# EAGLE schematic carret (EAGLE 5.11)
A: a
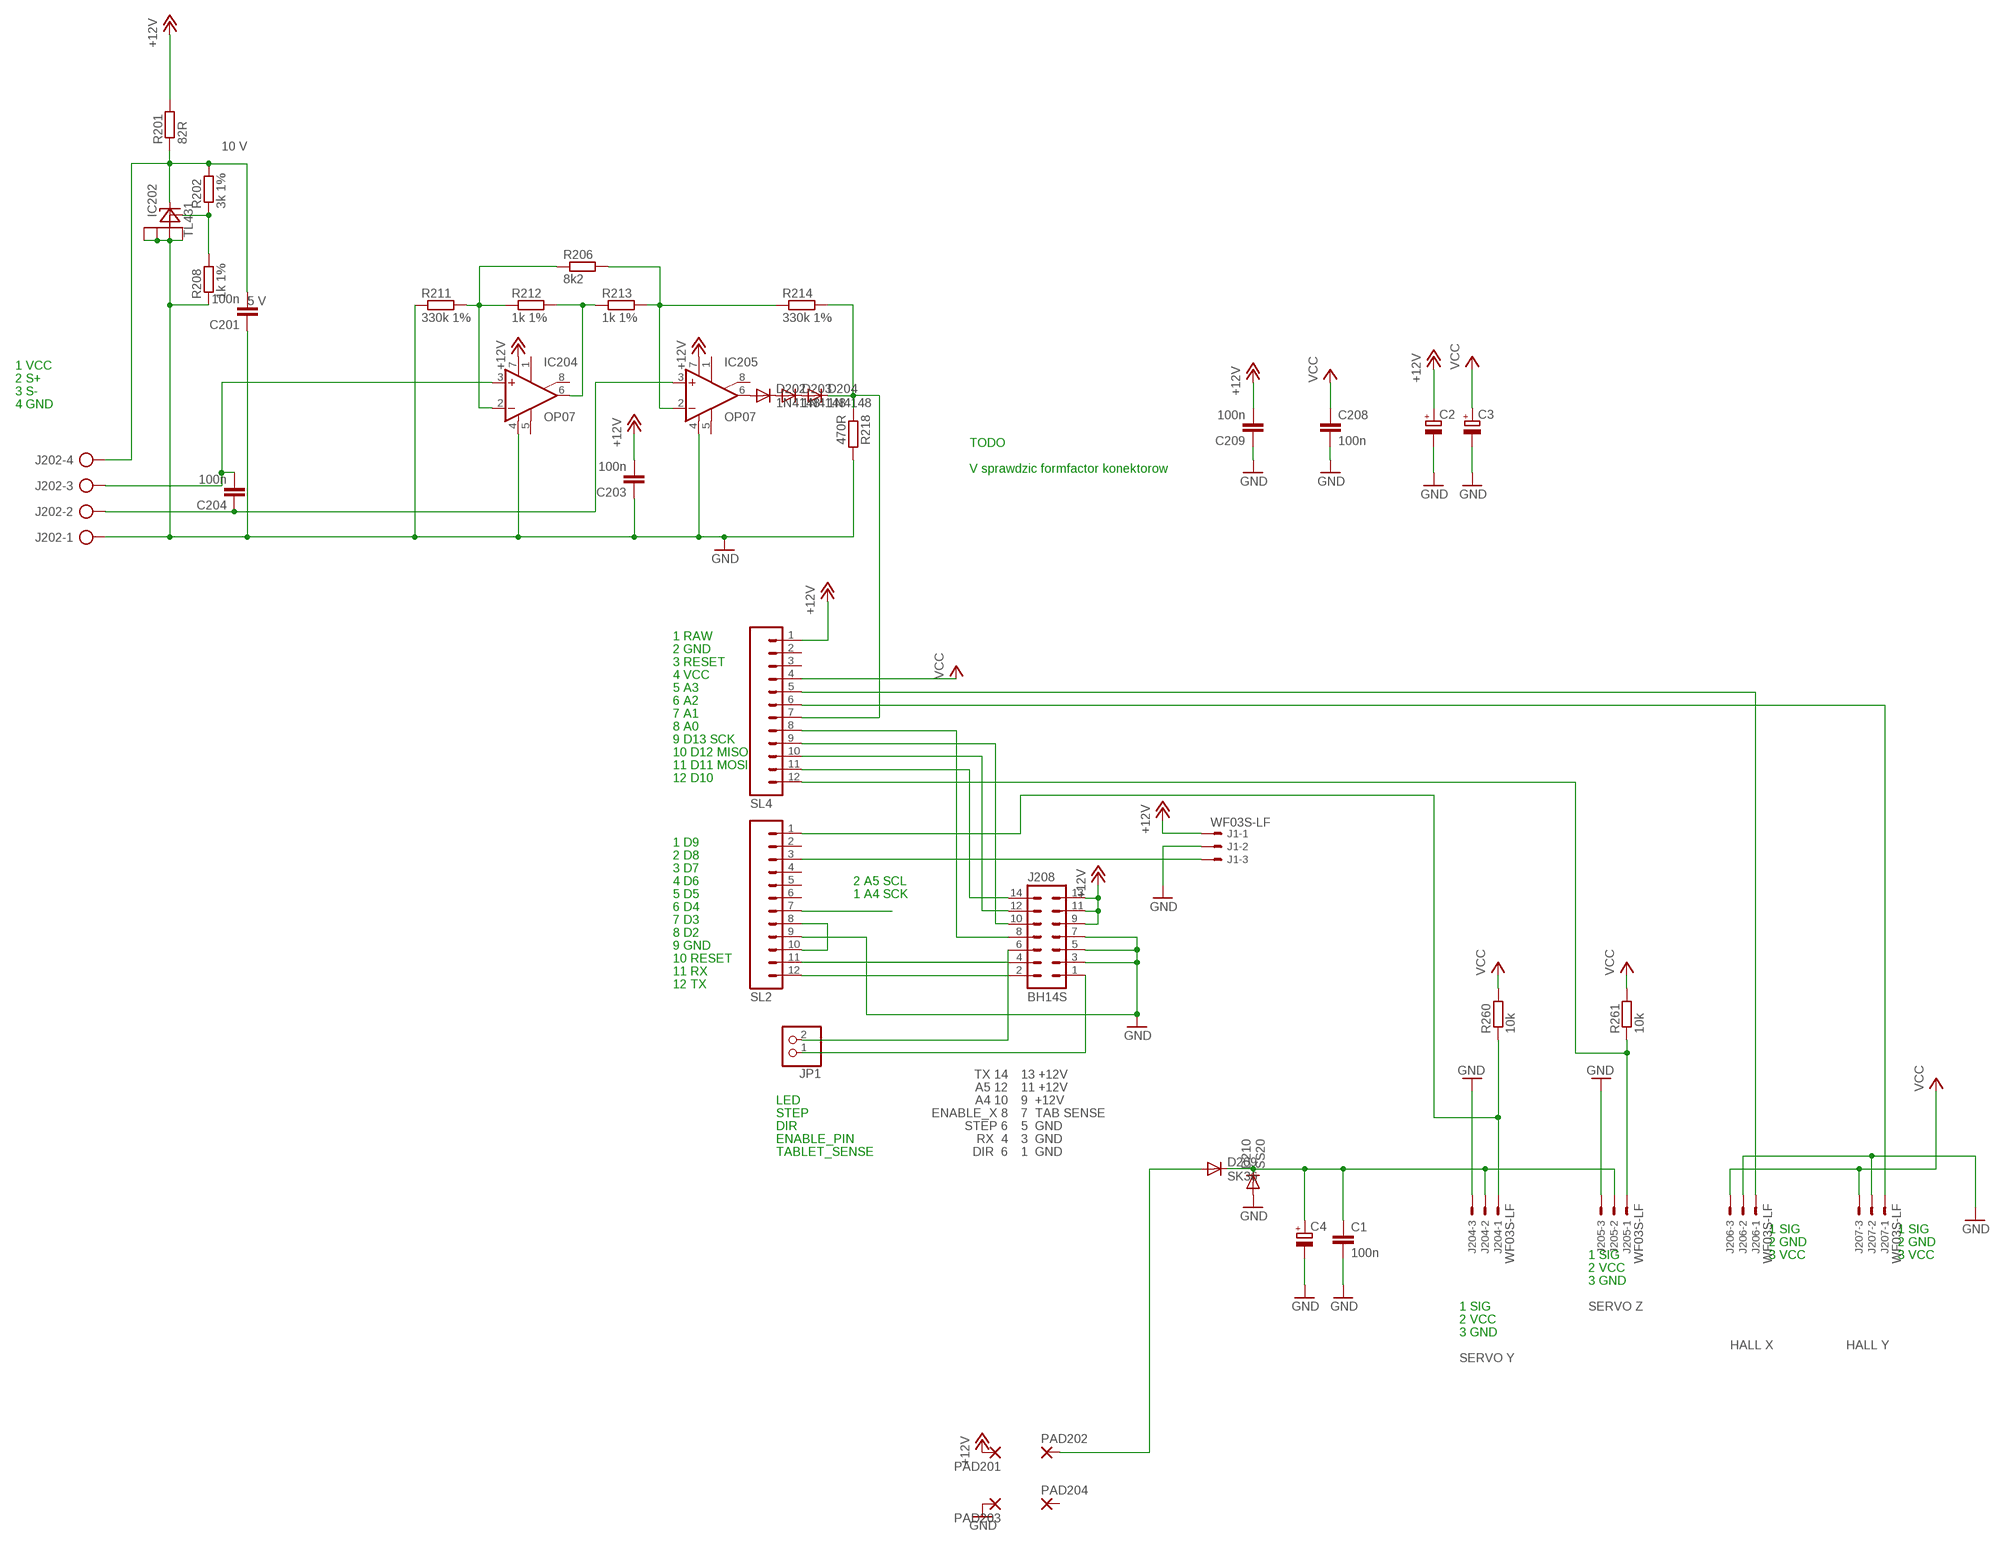
[diagram p0: schematic, sheet 1]

## Parts
C1  100n  CAP  [0805]
C2  CPOL-EUE3.5-8  [E3,5-8]
C3  CPOL-EUE3.5-8  [E3,5-8]
C4  CPOL-EUE3.5-8  [E3,5-8]
C201  100n  CAP  [0805]
C203  100n  CAP  [0805]
C204  100n  CAP  [0805]
C208  100n  CAP  [0805]
C209  100n  CAP  [0805]
D202  1N4148  DIODE-SOD80C  [SOD80C]
D203  1N4148  DIODE-SOD80C  [SOD80C]
D204  1N4148  DIODE-SOD80C  [SOD80C]
D209  SK36  DIODE-SMC  [SMC]
D210  SS20  DIODE-DO214AA  [DO214AA]
IC202  TL431  [SO08]
IC204  OP07  OP07CR  [SO08]
IC205  OP07  OP07CR  [SO08]
J1  WF03S-LF  22-27-2031-03  [6410-03]
J202  AK300/4  [AK300/4]
J204  WF03S-LF  22-27-2031-03  [6410-03]
J205  WF03S-LF  22-27-2031-03  [6410-03]
J206  WF03S-LF  22-27-2031-03  [6410-03]
J207  WF03S-LF  22-27-2031-03  [6410-03]
J208  BH14S  ML14  [ML14]
JP1  PINHD-1X2  [1X02]
PAD201  3,81/1,1  [3,81/1,1]
PAD202  3,81/1,1  [3,81/1,1]
PAD203  3,81/1,1  [3,81/1,1]
PAD204  3,81/1,1  [3,81/1,1]
R201  82R  RES0805  [0805]
R202  3k 1%  RES0805  [0805]
R206  8k2  RES0805  [0805]
R208  1k 1%  RES0805  [0805]
R211  330k 1%  RES0805  [0805]
R212  1k 1%  RES0805  [0805]
R213  1k 1%  RES0805  [0805]
R214  330k 1%  RES0805  [0805]
R218  470R  RES0805  [0805]
R260  10k  RES0805  [0805]
R261  10k  RES0805  [0805]
SL2  M12  [12P]
SL4  M12  [12P]

## Nets
+10V: C201.2 IC202.1(K) J202.4 R201.1 R202.2
+12V [power12]: C2.+ C203.2 C209.2 IC204.7(V+) IC205.7(V+) J1.1 J208.9 J208.11 J208.13 PAD201.1(P) R201.2 SL4.1
GND [ground]: C1.2 C2.- C3.- C4.- C201.1 C203.1 C208.2 C209.1 D210.A IC202.2(A) IC202.3(A1) IC202.6(A2) IC202.7(A3) IC204.4(V-) IC205.4(V-) J1.2 J202.1 J204.3 J205.3 J206.2 J207.2 J208.3 J208.5 J208.7 PAD203.1(P) R208.1 R211.1 R218.2 SL2.9
N$1: J204.1 R260.1 SL2.1
N$2: J208.4 SL2.11
N$3: J1.3 SL2.3
N$4: J208.6 JP1.2
N$6: J208.12 SL4.10
N$7: J208.8 SL4.8
N$8: J208.2 SL2.12
N$9: SL2.7
N$10: J205.1 R261.1 SL4.12
N$11 [power12]: C1.1 C4.+ D209.C D210.C J204.2 J205.2
N$12: J208.1 JP1.1
N$13: IC205.2(-IN) R206.2 R213.2 R214.1
N$14 [power12]: D209.A PAD202.1(P)
N$15: SL2.8 SL2.10
N$16: J208.10 SL4.9
N$17: J208.14 SL4.11
N$26: J207.1 SL4.6
N$28: J206.1 SL4.5
N$41: D204.C R214.2 R218.1 SL4.7
N$43: IC202.8(REF) R202.1 R208.2
N$49: C204.2 IC204.3(+IN) J202.3
N$50: C204.1 IC205.3(+IN) J202.2
N$51: IC204.2(-IN) R206.1 R211.2 R212.1
N$52: IC204.6(OUT) R212.2 R213.1
N$54: D202.A IC205.6(OUT)
N$55: D202.C D203.A
N$56: D203.C D204.A
VCC [power5]: C3.+ C208.1 J206.3 J207.3 R260.2 R261.2 SL4.4
Unconnected: IC204.1(ON1) IC204.5(OPT) IC204.8(ON2) IC205.1(ON1) IC205.5(OPT) IC205.8(ON2) PAD204.1(P) SL2.2 SL2.4 SL2.5 SL2.6 SL4.2 SL4.3

## Notes on the sheet
- 10 V
- 5 V
- 1 VCC
- 2 S+
- 3 S-
- 4 GND
- TODO
- V sprawdzic formfactor konektorow
- 1 RAW
- 2 GND
- 3 RESET
- 4 VCC
- 5 A3
- 6 A2
- 7 A1
- 8 A0
- 9 D13 SCK
- 10 D12 MISO
- 11 D11 MOSI
- 12 D10
- 1 D9
- 2 D8
- 3 D7
- 4 D6 | 2 A5 SCL
- 5 D5 | 1 A4 SCK
- 6 D4
- 7 D3
- 8 D2
- 9 GND
- 10 RESET
- 11 RX
- 12 TX
- TX 14 | 13 +12V
- A5 12 | 11 +12V
- LED | A4 10 | 9  +12V
- STEP | ENABLE_X 8 | 7  TAB SENSE
- DIR | STEP 6 | 5  GND
- ENABLE_PIN | RX  4 | 3  GND
- TABLET_SENSE | DIR  6 | 1  GND
- 1 SIG | 1 SIG
- 2 GND | 2 GND
- 1 SIG | 3 VCC | 3 VCC
- 2 VCC
- 3 GND
- 1 SIG | SERVO Z
- 2 VCC
- 3 GND
- HALL X | HALL Y
- SERVO Y

## Library data of the parts
C1 C201 C203 C204 C208 C209 = barobot:CAP
C2-C4 = rcl:CPOL-EU: POLARIZED CAPACITOR, European symbol
D202-D204 D209 D210 = diode:DIODE-: DIODE
IC202 = 0alib:TL431
IC204 IC205 = linear:OP07*: OP AMP
J1 J204-J207 = con-molex:22-?-03: CONNECTOR wire to board 2.54 mm (.1 inch) pitch header; OC_FARNELL: unknown; OC_NEWARK: unknown
J202 = con-ptr500:AK300/4: CONNECTOR
J208 = con-ml:ML14: HARTING
JP1 = pinhead:PINHD-1X2: PIN HEADER
PAD201-PAD204 = wirepad:3,81/1,1: THROUGH-HOLE PAD
R201 R202 R206 R208 R211-R214 R218 R260 R261 = barobot:RES
SL2 SL4 = con-amp-quick:M12: AMP QUICK CONNECTOR; OC_FARNELL: unknown; OC_NEWARK: unknown

## Net classes
0 default: width 0.381 mm, drill 0.254 mm, clearance 0.254 mm
1 power12: width 1.27 mm
2 ground: width 0.508 mm
3 power5: width 0.508 mm